# EAGLE schematic Audio_Jack_Interface (EAGLE 6.4)
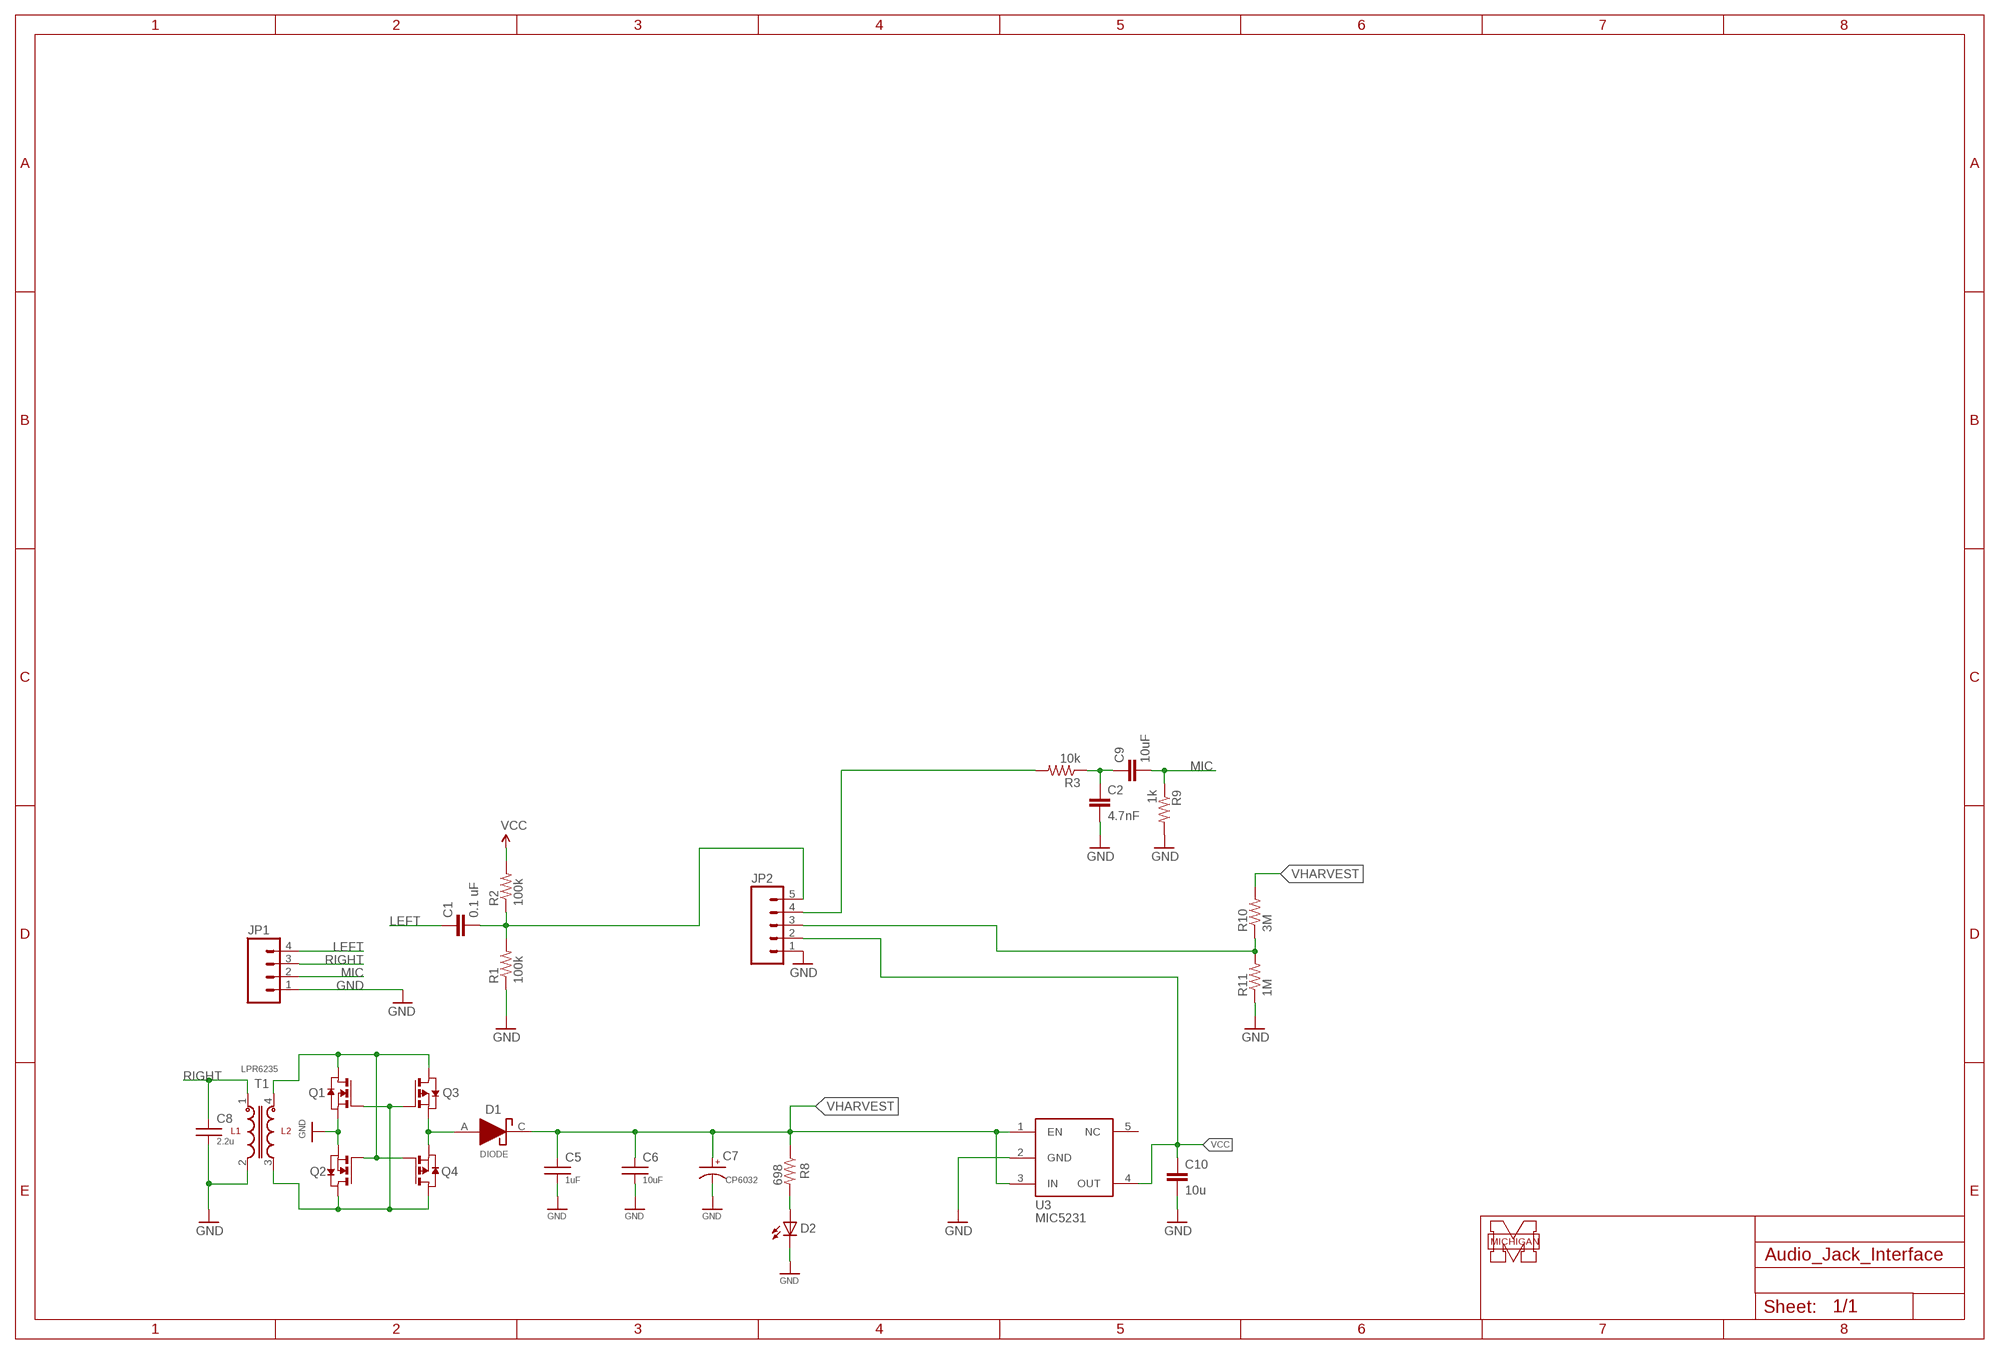
[diagram p0: schematic, sheet 1]

## Parts
C1  0.1 uF  CAP0603-CAP  [0603-CAP]
C2  4.7nF  CAP0603-CAP  [0603-CAP]
C5  1uF  C0603  [C0603]
C6  10uF  C0603  [C0603]
C7  CP6032  [CT6032]
C8  2.2u  C0603  [C0603]
C9  10uF  CAP0603-CAP  [0603-CAP]
C10  10u  C-EUC0603  [C0603]
D1  DIODE  [MINIMELF]
D2  LED0603  [LED-0603]
JP1  M041.27MM  [1X04-1.27MM]
JP2  M05PTH  [1X05]
Q1  NMOSSOT23  [SOT-23]
Q2  NMOSSOT23  [SOT-23]
Q3  PMOSSOT23  [SOT-23]
Q4  PMOSSOT23  [SOT-23]
R1  100k  RESISTOR0603-RES  [0603-RES]
R2  100k  RESISTOR0603-RES  [0603-RES]
R3  10k  RESISTOR0603-RES  [0603-RES]
R8  698  R-US_R0603  [R0603]
R9  1k  RESISTOR0603-RES  [0603-RES]
R10  3M  RESISTOR0603-RES  [0603-RES]
R11  1M  RESISTOR0603-RES  [0603-RES]
T1  LPR6235  [LPR6235]
U3  MIC5231  [SOT23-5]

## Nets
GND: C2.2 C5.2 C6.2 C7.- C8.2 C10.2 D2.C JP1.1 JP2.1 Q1.2(S) Q2.2(S) R1.1 R9.2 R11.1 T1.2 U3.2(GND)
LEFT: C1.1 JP1.4
MIC: C9.2 JP1.2 R9.1
N$1: C1.2 JP2.5 R1.2 R2.1
N$3: JP2.3 R10.1 R11.2
N$7: JP2.4 R3.2
N$8: Q1.1(D) Q2.3(G) Q3.1(D) Q4.3(G) T1.4
N$9: Q1.3(G) Q2.1(D) Q3.3(G) Q4.1(D) T1.3
N$11: D2.A R8.2
N$12: C2.1 C9.1 R3.1
N$17: D1.A Q3.2(S) Q4.2(S)
RIGHT: C8.1 JP1.3 T1.1
VCC: C10.1 JP2.2 R2.2 U3.4(OUT)
VHARVEST: C5.1 C6.1 C7.+ D1.C R8.1 R10.2 U3.1(EN) U3.3(IN)
Unconnected: U3.5(NC)

## Notes on the sheet
- MICHIGAN

## Library data of the parts
C1 C2 C9 = SparkFun:CAP: Capacitor Standard 0603 ceramic capacitor, and 0.1" leaded capacitor.
C5 C6 C8 = umich:C
C7 = umich:CP
C10 = rcl:C-EU: CAPACITOR, European symbol
D1 = umich:DIODE
D2 = umich:LED: LEDs Standard schematic elements and footprints for 5mm, 3mm, 1206, and 0603 sized LEDs. 5mm - Spark Fun Electronics SKU : COM-00529 (and others)
JP1 = SparkFun-Connectors:M04: Header 4 Standard 4-pin 0.1" header. Use with straight break away headers (SKU : PRT-00116), right angle break away headers (PRT-00553), swiss pins (PRT-00743), machine pins (PRT-00117), and female headers (PRT-00115). Molex polarized connector foot print use with SKU : PRT-08231 with associated crimp pins and housings. 1MM SMD Version SKU: PRT-10208
JP2 = SparkFun-Connectors:M05: Header 5 Standard 5-pin 0.1" header. Use with straight break away headers (SKU : PRT-00116), right angle break away headers (PRT-00553), swiss pins (PRT-00743), machine pins (PRT-00117), and female headers (PRT-00115). Molex polarized connector foot print use with SKU : PRT-08230 with associated crimp pins and housings.
Q1 Q2 = zetex:NMOSSOT23: MOS FET
Q3 Q4 = zetex:PMOSSOT23: MOS FET
R1-R3 R9-R11 = SparkFun:RESISTOR: Resistor Basic schematic elements and footprints for 0603, 1206, and PTH 1/10th watt (small) resistors.
R8 = rcl:R-US_: RESISTOR, American symbol
T1 = umich:LPR6235
U3 = berkeley-epic:MIC5231